# EAGLE design RAMPS_1.6.2 (EAGLE 9.1.1)
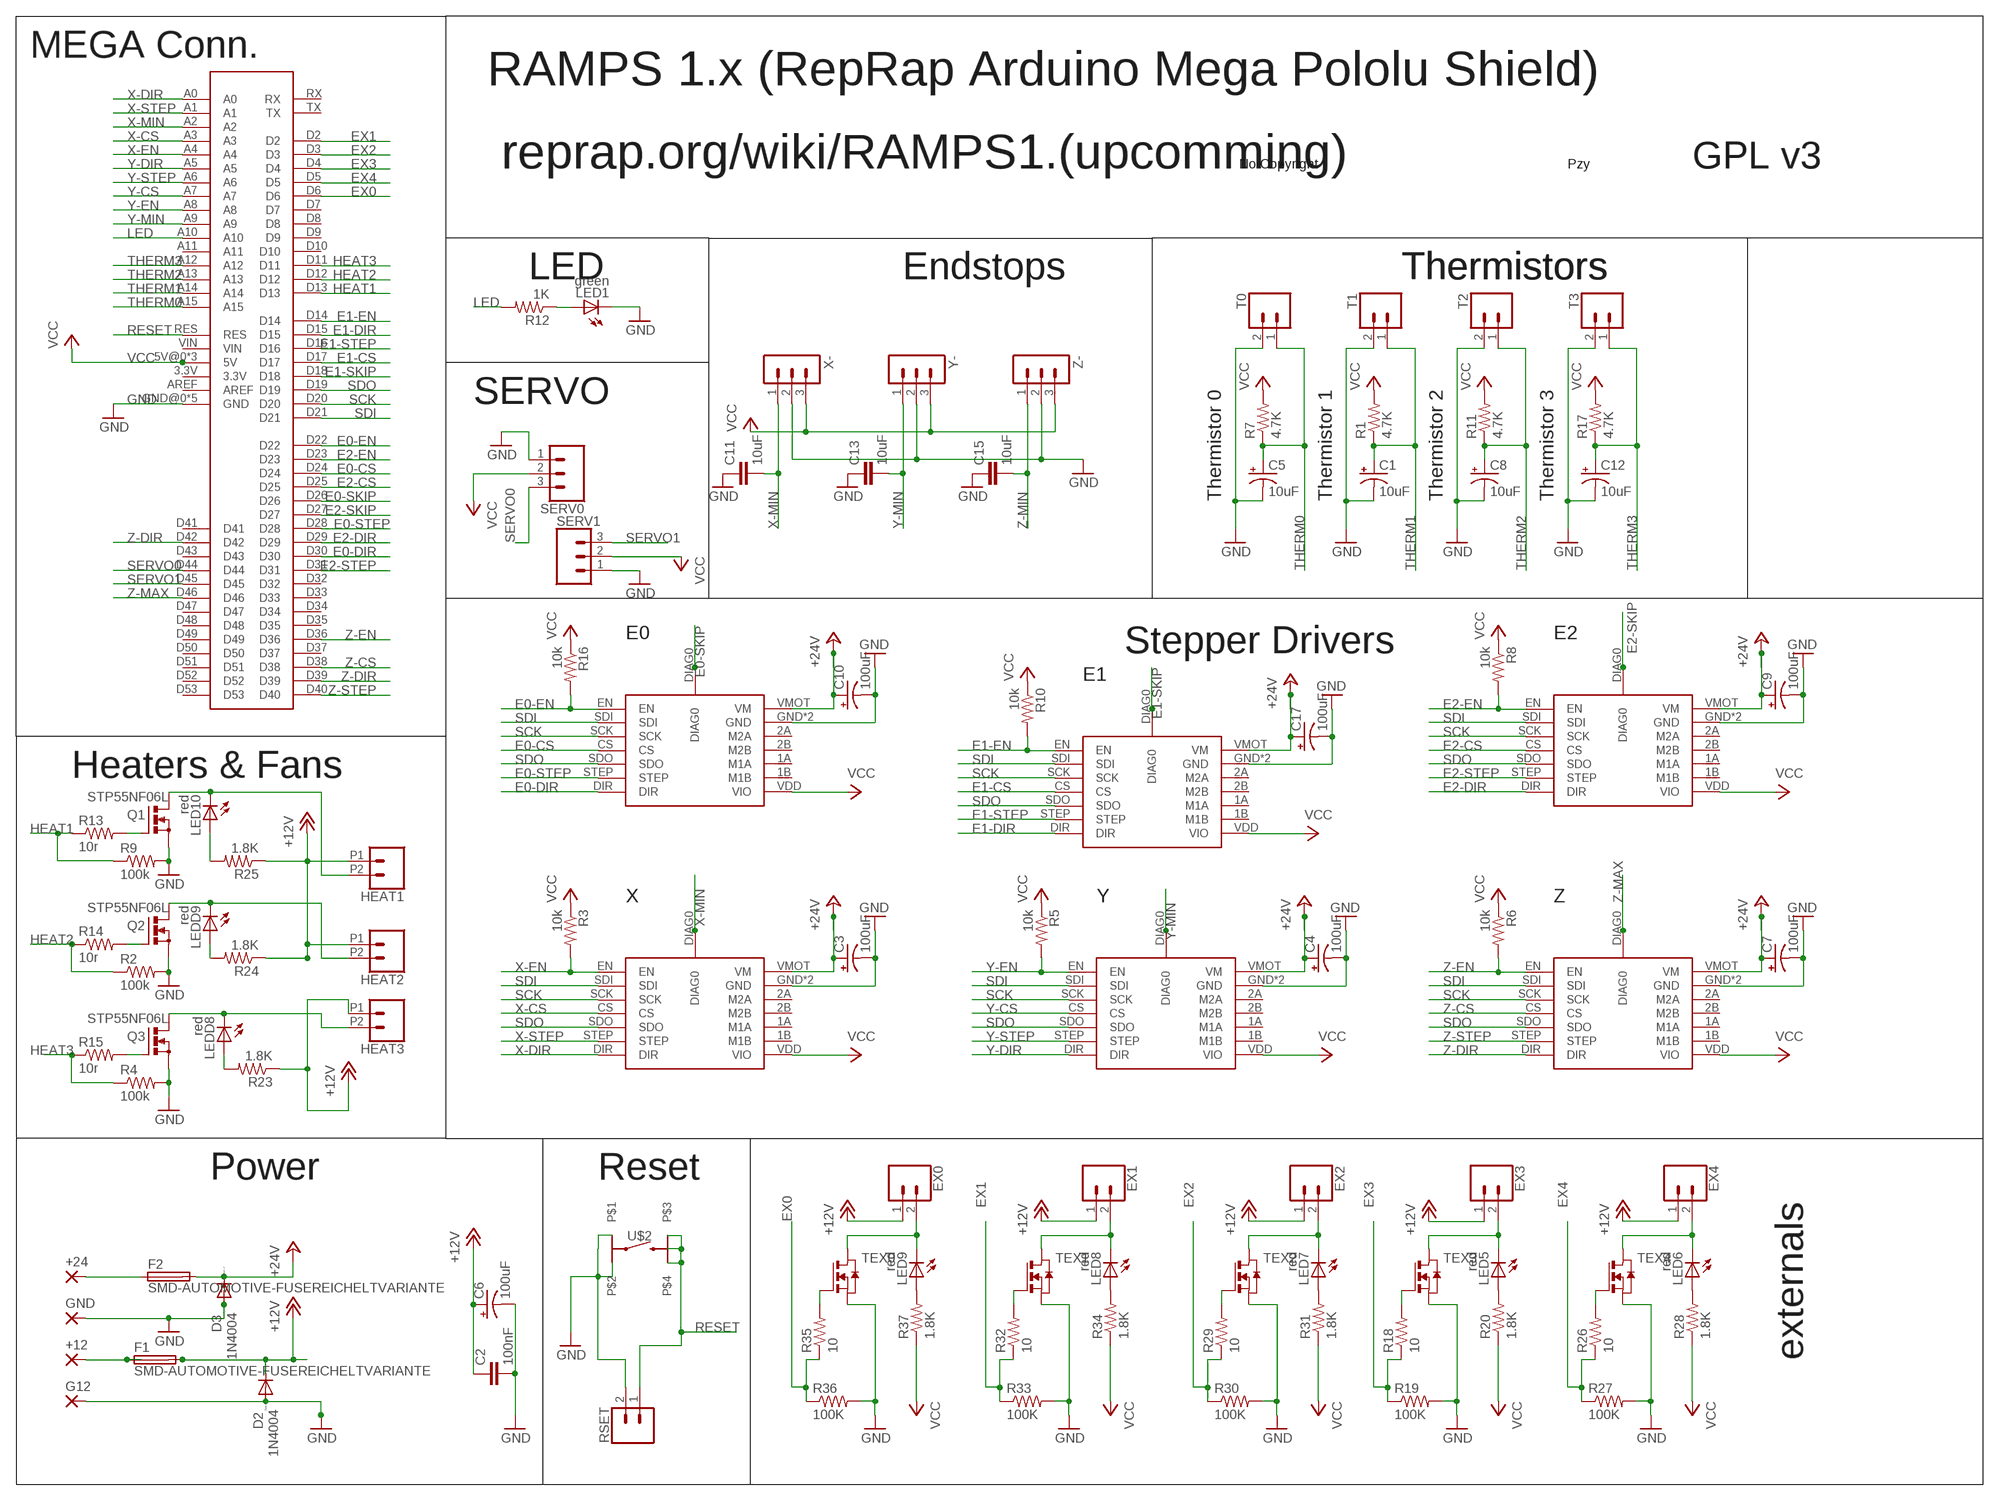
[diagram p0: schematic, sheet 1]

## Parts
+12  2,15/1,0  [2,15/1,0]
+24  2,15/1,0  [2,15/1,0]
C1  10uF  CPOL-US153CLV-0405  [153CLV-0405]
C2  100nF  C-EUC1206  [C1206]
C3  100uF  CPOL-US153CLV-0605  [153CLV-0605]
C4  100uF  CPOL-US153CLV-0605  [153CLV-0605]
C5  10uF  CPOL-US153CLV-0405  [153CLV-0405]
C6  100uF  CPOL-US153CLV-0605  [153CLV-0605]
C7  100uF  CPOL-US153CLV-0605  [153CLV-0605]
C8  10uF  CPOL-US153CLV-0405  [153CLV-0405]
C9  100uF  CPOL-US153CLV-0605  [153CLV-0605]
C10  100uF  CPOL-US153CLV-0605  [153CLV-0605]
C11  10uF  C-EUC1206  [C1206]
C12  10uF  CPOL-US153CLV-0405  [153CLV-0405]
C13  10uF  C-EUC1206  [C1206]
C15  10uF  C-EUC1206  [C1206]
C17  100uF  CPOL-US153CLV-0605  [153CLV-0605]
D2  1N4004  [DO41-10]
D3  1N4004  [DO41-10]
E0  TMC2130DIAG  [TMC2130DIAG0]
E1  TMC2130DIAG  [TMC2130DIAG0]
E2  TMC2130DIAG  [TMC2130DIAG0]
EX0  CONN_02POLAR_LOCK  [MOLEX-1X2_LOCK]
EX1  CONN_02POLAR_LOCK  [MOLEX-1X2_LOCK]
EX2  CONN_02POLAR_LOCK  [MOLEX-1X2_LOCK]
EX3  CONN_02POLAR_LOCK  [MOLEX-1X2_LOCK]
EX4  CONN_02POLAR_LOCK  [MOLEX-1X2_LOCK]
F1  SMD-AUTOMOTIVE-FUSEREICHELTVARIANTE  [RS-SMDFUSE]
F2  SMD-AUTOMOTIVE-FUSEREICHELTVARIANTE  [RS-SMDFUSE]
G12  2,15/1,0  [2,15/1,0]
GND  2,15/1,0  [2,15/1,0]
HEAT1  CONN_022.54MM_SCREWTERM  [1X02_2.54_SCREWTERM]
HEAT2  CONN_022.54MM_SCREWTERM  [1X02_2.54_SCREWTERM]
HEAT3  CONN_022.54MM_SCREWTERM  [1X02_2.54_SCREWTERM]
LED1  green  LEDCHIPLED_1206  [CHIPLED_1206]
LED5  red  LEDCHIPLED_1206  [CHIPLED_1206]
LED6  red  LEDCHIPLED_1206  [CHIPLED_1206]
LED7  red  LEDCHIPLED_1206  [CHIPLED_1206]
LED8  red  LEDCHIPLED_1206  [CHIPLED_1206]
LED9  red  LEDCHIPLED_1206  [CHIPLED_1206]
LED10  red  LEDCHIPLED_1206  [CHIPLED_1206]
LEDD8  red  LEDCHIPLED_1206  [CHIPLED_1206]
LEDD9  red  LEDCHIPLED_1206  [CHIPLED_1206]
Q1  STP55NF06L  IRF512  [TO220BV]
Q2  STP55NF06L  IRF512  [TO220BV]
Q3  STP55NF06L  IRF512  [TO220BV]
R1  4.7K  R-US_R1206  [R1206]
R2  100k  R-US_R1206  [R1206]
R3  10k  R-US_R1206  [R1206]
R4  100k  R-US_R1206  [R1206]
R5  10k  R-US_R1206  [R1206]
R6  10k  R-US_R1206  [R1206]
R7  4.7K  R-US_R1206  [R1206]
R8  10k  R-US_R1206  [R1206]
R9  100k  R-US_R1206  [R1206]
R10  10k  R-US_R1206  [R1206]
R11  4.7K  R-US_R1206  [R1206]
R12  1K  R-US_R1206  [R1206]
R13  10r  R-US_R1206  [R1206]
R14  10r  R-US_R1206  [R1206]
R15  10r  R-US_R1206  [R1206]
R16  10k  R-US_R1206  [R1206]
R17  4.7K  R-US_R1206  [R1206]
R18  10  R-US_R1206  [R1206]
R19  100K  R-US_R1206  [R1206]
R20  1.8K  R-US_R1206  [R1206]
R23  1.8K  R-US_R1206  [R1206]
R24  1.8K  R-US_R1206  [R1206]
R25  1.8K  R-US_R1206  [R1206]
R26  10  R-US_R1206  [R1206]
R27  100K  R-US_R1206  [R1206]
R28  1.8K  R-US_R1206  [R1206]
R29  10  R-US_R1206  [R1206]
R30  100K  R-US_R1206  [R1206]
R31  1.8K  R-US_R1206  [R1206]
R32  10  R-US_R1206  [R1206]
R33  100K  R-US_R1206  [R1206]
R34  1.8K  R-US_R1206  [R1206]
R35  10  R-US_R1206  [R1206]
R36  100K  R-US_R1206  [R1206]
R37  1.8K  R-US_R1206  [R1206]
RSET  CONN_02POLAR_LOCK  [MOLEX-1X2_LOCK]
SERV0  CONN_03  [1X03]
SERV1  CONN_03  [1X03]
T0  CONN_02LOCK  [1X02_LOCK]
T1  CONN_02LOCK  [1X02_LOCK]
T2  CONN_02LOCK  [1X02_LOCK]
T3  CONN_02LOCK  [1X02_LOCK]
TEX0  NMOSSOT223  [SOT223]
TEX1  NMOSSOT223  [SOT223]
TEX2  NMOSSOT223  [SOT223]
TEX3  NMOSSOT223  [SOT223]
TEX4  NMOSSOT223  [SOT223]
U$1  ARDUINOSHIELD  [REPRAPJR_ARDUINO_MEGA_SHIELD]
U$2  RS-TASTER  [RS-SWITCH]
X  TMC2130DIAG  [TMC2130DIAG0]
X-  3PIN-HEADER  [3PIN-HEADER]
Y  TMC2130DIAG  [TMC2130DIAG0]
Y-  3PIN-HEADER  [3PIN-HEADER]
Z  TMC2130DIAG  [TMC2130DIAG0]
Z-  3PIN-HEADER  [3PIN-HEADER]

## Nets
+12V [12pow]: C2.1 C6.+ D2.C EX0.1 EX1.1 EX2.1 EX3.1 EX4.1 F1.P$5 F1.P$6 F1.P$7 F1.P$8 HEAT1.P1 HEAT2.P1 HEAT3.P1 R23.1 R24.1 R25.1
+24V: C3.+ C4.+ C7.+ C9.+ C10.+ C17.+ D3.C E0.VMOT(VM) E1.VMOT(VM) E2.VMOT(VM) F2.P$5 F2.P$6 F2.P$7 F2.P$8 X.VMOT(VM) Y.VMOT(VM) Z.VMOT(VM)
E0-CS [signal]: E0.CS U$1.D24
E0-DIR [signal]: E0.DIR U$1.D30
E0-EN [signal]: E0.EN R16.2 U$1.D22
E0-SKIP [signal]: E0.DIAG0 U$1.D26
E0-STEP [signal]: E0.STEP U$1.D28
E1-CS [signal]: E1.CS U$1.D17
E1-DIR [signal]: E1.DIR U$1.D15
E1-EN [signal]: E1.EN R10.2 U$1.D14
E1-SKIP [signal]: E1.DIAG0 U$1.D18
E1-STEP [signal]: E1.STEP U$1.D16
E2-CS [signal]: E2.CS U$1.D25
E2-DIR [signal]: E2.DIR U$1.D29
E2-EN [signal]: E2.EN R8.2 U$1.D23
E2-SKIP: E2.DIAG0 U$1.D27
E2-STEP [signal]: E2.STEP U$1.D31
EX0 [signal]: R35.1 R36.1 U$1.D6
EX1 [signal]: R32.1 R33.1 U$1.D2
EX2 [signal]: R29.1 R30.1 U$1.D3
EX3 [signal]: R18.1 R19.1 U$1.D4
EX4 [signal]: R26.1 R27.1 U$1.D5
GND [signal]: C1.- C2.2 C3.- C4.- C5.- C6.- C7.- C8.- C9.- C10.- C11.1 C12.- C13.1 C15.1 C17.- D2.A D3.A E0.GND E0.GND@0(GND) E1.GND E1.GND@0(GND) E2.GND E2.GND@0(GND) G12.1(P) GND.1(P) LED1.C Q1.S Q2.S Q3.S R2.2 R4.2 R9.2 R19.2 R27.2 R30.2 R33.2 R36.2 RSET.2 SERV0.1 SERV1.1 T0.2 T1.2 T2.2 T3.2 TEX0.3(S) TEX1.3(S) TEX2.3(S) TEX3.3(S) TEX4.3(S) U$1.GND@0(GND) U$1.GND@1(GND) U$1.GND@2(GND) U$1.GND@3(GND) U$1.GND@4(GND) U$2.P$1 U$2.P$2 X-.2 X.GND X.GND@0(GND) Y-.2 Y.GND Y.GND@0(GND) Z-.2 Z.GND Z.GND@0(GND)
HEAT1 [signal]: R9.1 R13.1 U$1.D13
HEAT2 [signal]: R2.1 R14.1 U$1.D12
HEAT3 [signal]: R4.1 R15.1 U$1.D11
LED [signal]: R12.2 U$1.A10
N$1 [signal]: HEAT2.P2 LEDD9.C Q2.D
N$2 [signal]: R18.2 TEX3.1(G)
N$7 [signal]: HEAT1.P2 LED10.C Q1.D
N$12 [signal]: EX3.2 LED5.C TEX3.2(D) TEX3.4(D)
N$17 [signal]: LED5.A R20.2
N$22 [signal]: EX2.2 LED7.C TEX2.2(D) TEX2.4(D)
N$24 [signal]: R26.2 TEX4.1(G)
N$28 [signal]: EX4.2 LED6.C TEX4.2(D) TEX4.4(D)
N$32 [signal]: LEDD8.A R23.2
N$34 [signal]: LED6.A R28.2
N$36 [signal]: R29.2 TEX2.1(G)
N$38 [signal]: LED7.A R31.2
N$40 [signal]: R32.2 TEX1.1(G)
N$41 [signal]: EX1.2 LED8.C TEX1.2(D) TEX1.4(D)
N$42 [signal]: LED8.A R34.2
N$44 [signal]: R35.2 TEX0.1(G)
N$45 [signal]: LEDD9.A R24.2
N$46 [signal]: LED1.A R12.1
N$47 [signal]: Q2.G R14.2
N$48 [signal]: Q1.G R13.2
N$49 [signal]: Q3.G R15.2
N$50 [signal]: LED10.A R25.2
N$51 [signal]: HEAT3.P2 LEDD8.C Q3.D
N$53: +24.1(P) F2.P$1 F2.P$2 F2.P$3 F2.P$4
N$54 [signal]: +12.1(P) F1.P$1 F1.P$2 F1.P$3 F1.P$4
N$56 [signal]: EX0.2 LED9.C TEX0.2(D) TEX0.4(D)
N$57 [signal]: LED9.A R37.2
RESET [signal]: RSET.1 U$1.RES U$2.P$3 U$2.P$4
SCK [signal]: E0.SCK E1.SCK E2.SCK U$1.D20 X.SCK Y.SCK Z.SCK
SDI [signal]: E0.SDI E1.SDI E2.SDI U$1.D21 X.SDI Y.SDI Z.SDI
SDO [signal]: E0.SDO E1.SDO E2.SDO U$1.D19 X.SDO Y.SDO Z.SDO
SERVO0 [signal]: SERV0.3 U$1.D44
SERVO1 [signal]: SERV1.3 U$1.D45
THERM0 [signal]: C5.+ R7.1 T0.1 U$1.A15
THERM1 [signal]: C1.+ R1.1 T1.1 U$1.A14
THERM2 [signal]: C8.+ R11.1 T2.1 U$1.A13
THERM3 [signal]: C12.+ R17.1 T3.1 U$1.A12
VCC [vcc]: E0.VDD(VIO) E1.VDD(VIO) E2.VDD(VIO) R1.2 R3.1 R5.1 R6.1 R7.2 R8.1 R10.1 R11.2 R16.1 R17.2 R20.1 R28.1 R31.1 R34.1 R37.1 SERV0.2 SERV1.2 U$1.5V@0(5V) U$1.5V@1(5V) U$1.5V@2(5V) X-.3 X.VDD(VIO) Y-.3 Y.VDD(VIO) Z-.3 Z.VDD(VIO)
X-CS [signal]: U$1.A3 X.CS
X-DIR [signal]: U$1.A0 X.DIR
X-EN [signal]: R3.2 U$1.A4 X.EN
X-MIN [signal]: C11.2 U$1.A2 X-.1 X.DIAG0
X-STEP [signal]: U$1.A1 X.STEP
Y-CS [signal]: U$1.A7 Y.CS
Y-DIR [signal]: U$1.A5 Y.DIR
Y-EN [signal]: R5.2 U$1.A8 Y.EN
Y-MIN [signal]: C13.2 U$1.A9 Y-.1 Y.DIAG0
Y-STEP [signal]: U$1.A6 Y.STEP
Z-CS [signal]: U$1.D38 Z.CS
Z-DIR [signal]: U$1.D39 U$1.D42 Z.DIR
Z-EN [signal]: R6.2 U$1.D36 Z.EN
Z-MAX [signal]: U$1.D46 Z.DIAG0
Z-MIN [signal]: C15.2 Z-.1
Z-STEP [signal]: U$1.D40 Z.STEP
Unconnected: E0.1A(M1A) E0.1B(M1B) E0.2A(M2A) E0.2B(M2B) E1.1A(M1A) E1.1B(M1B) E1.2A(M2A) E1.2B(M2B) E2.1A(M1A) E2.1B(M1B) E2.2A(M2A) E2.2B(M2B) U$1.3.3V U$1.A11 U$1.AREF U$1.D7 U$1.D8 U$1.D9 U$1.D10 U$1.D32 U$1.D33 U$1.D34 U$1.D35 U$1.D37 U$1.D41 U$1.D43 U$1.D47 U$1.D48 U$1.D49 U$1.D50 U$1.D51 U$1.D52 U$1.D53 U$1.RX U$1.TX U$1.VIN X.1A(M1A) X.1B(M1B) X.2A(M2A) X.2B(M2B) Y.1A(M1A) Y.1B(M1B) Y.2A(M2A) Y.2B(M2B) Z.1A(M1A) Z.1B(M1B) Z.2A(M2A) Z.2B(M2B)

## Notes on the sheet
- MEGA Conn.
- RAMPS 1.x (RepRap Arduino Mega Pololu Shield)
- reprap.org/wiki/RAMPS1.(upcomming) | No Copyright | Pzy | GPL v3
- LED | Endstops | Thermistors | Thermistors
- SERVO
- Thermistor 0 | Thermistor 1 | Thermistor 2 | Thermistor 3
- E0 | E2
- Stepper Drivers
- E1
- Heaters & Fans
- X | Y | Z
- Power | Reset
- externals

## Library data of the parts
+12 +24 G12 GND = wirepad:2,15/1,0: THROUGH-HOLE PAD
C1 C3-C10 C12 C17 = adafruit:CPOL-US: POLARIZED CAPACITOR, American symbol
C2 = resistor:C-EU: CAPACITOR, European symbol
C11 C13 C15 = rcl:C-EU: CAPACITOR, European symbol; SPICEPREFIX: C
D2 D3 = diode:1N4004: DIODE general purpose rectifier, 1 A
E0 E1 E2 X Y Z = RAMPS_1.4.2.3:TMC2130DIAG
EX0 EX1-EX4 RSET = SparkFun-Connectors:CONN_02: Multi connection point. Often used as Generic Header-pin footprint for 0.1 inch spaced/style header connections On any of the 0.1 inch spaced packages, you can populate with these: Break Away Headers - Straight <https://www.sparkfun.com/products/116> (PRT-00116) Break Away Male Headers - Right Angle <https://www.sparkfun.com/products/553> (PRT-00553) Female Headers <https://www.sparkfun.com/products/115> (PRT-00115) Break Away Headers - Machine Pin <https://www.sparkfun.com/products/117> (PRT-00117) Break Away Female Headers - Swiss Machine Pin <https://www.sparkfun.com/products/743> (PRT-00743) For SCREWTERMINALS and SPRING TERMINALS visit here: Screw Terimnals on SparkFun.com <https://www.sparkfun.com/search/results?term=Screw+Terminals> (5mm/3.5mm/2.54mm spacing) This device is also useful as a general connection point to wire up your design to another part of your project. Our various solder wires solder well into these plated through hole pads. Hook-Up Wire - Assortment (Stranded, 22 AWG) <https://www.sparkfun.com/products/11375> (PRT-11375) Hook-Up Wire - Assortment (Solid Core, 22 AWG) <https://www.sparkfun.com/products/11367> (PRT-11367) View the entire wire category on our website here <https://www.sparkfun.com/categories/141> Special notes: Molex polarized connector foot print use with: PRT-08233 with associated crimp pins and housings. 2.54_SCREWTERM for use with PRT-10571. 3.5mm Screw Terminal footprints for PRT-08084 5mm Screw Terminal footprints for use with PRT-08432; SF_ID: PRT-09918; SPICEPREFIX: B
F1 F2 = My lib:SMD-AUTOMOTIVE-FUSE: Surface mount fuse holder for kfz blade fuses eu.mouser.com/ProductDetail/Keystone-Electronics/3588?qs=sGAEpiMZZMtRmoYvq3OwzPu1j8c6R%252bXbiEp%2fc%252bjR%2fsE%3d
HEAT1-HEAT3 T0 T1-T3 = SparkFun-Connectors:CONN_02: Multi connection point. Often used as Generic Header-pin footprint for 0.1 inch spaced/style header connections On any of the 0.1 inch spaced packages, you can populate with these: Break Away Headers - Straight <https://www.sparkfun.com/products/116> (PRT-00116) Break Away Male Headers - Right Angle <https://www.sparkfun.com/products/553> (PRT-00553) Female Headers <https://www.sparkfun.com/products/115> (PRT-00115) Break Away Headers - Machine Pin <https://www.sparkfun.com/products/117> (PRT-00117) Break Away Female Headers - Swiss Machine Pin <https://www.sparkfun.com/products/743> (PRT-00743) For SCREWTERMINALS and SPRING TERMINALS visit here: Screw Terimnals on SparkFun.com <https://www.sparkfun.com/search/results?term=Screw+Terminals> (5mm/3.5mm/2.54mm spacing) This device is also useful as a general connection point to wire up your design to another part of your project. Our various solder wires solder well into these plated through hole pads. Hook-Up Wire - Assortment (Stranded, 22 AWG) <https://www.sparkfun.com/products/11375> (PRT-11375) Hook-Up Wire - Assortment (Solid Core, 22 AWG) <https://www.sparkfun.com/products/11367> (PRT-11367) View the entire wire category on our website here <https://www.sparkfun.com/categories/141> Special notes: Molex polarized connector foot print use with: PRT-08233 with associated crimp pins and housings. 2.54_SCREWTERM for use with PRT-10571. 3.5mm Screw Terminal footprints for PRT-08084 5mm Screw Terminal footprints for use with PRT-08432
LED1 LED10 LEDD8 LEDD9 = led:LED: LED OSRAM: - CHIPLED LG R971, LG N971, LY N971, LG Q971, LY Q971, LO R971, LY R971 LH N974, LH R974 LS Q976, LO Q976, LY Q976 LO Q996 - Hyper CHIPLED LW Q18S LB Q993, LB Q99A, LB R99A - SideLED LS A670, LO A670, LY A670, LG A670, LP A670 LB A673, LV A673, LT A673, LW A673 LH A674 LY A675 LS A676, LA A676, LO A676, LY A676, LW A676 LS A679, LY A679, LG A679 - Hyper Micro SIDELED® LS Y876, LA Y876, LO Y876, LY Y876 LT Y87S - SmartLED LW L88C, LW L88S LB L89C, LB L89S, LG L890 LS L89K, LO L89K, LY L89K LS L896, LA L896, LO L896, LY L896 - TOPLED LS T670, LO T670, LY T670, LG T670, LP T670 LSG T670, LSP T670, LSY T670, LOP T670, LYG T670 LG T671, LOG T671, LSG T671 LB T673, LV T673, LT T673, LW T673 LH T674 LS T676, LA T676, LO T676, LY T676, LB T676, LH T676, LSB T676, LW T676 LB T67C, LV T67C, LT T67C, LS T67K, LO T67K, LY T67K, LW E67C LS E67B, LA E67B, LO E67B, LY E67B, LB E67C, LV E67C, LT E67C LW T67C LS T679, LY T679, LG T679 LS T770, LO T770, LY T770, LG T770, LP T770 LB T773, LV T773, LT T773, LW T773 LH T774 LS E675, LA E675, LY E675, LS T675 LS T776, LA T776, LO T776, LY T776, LB T776 LHGB T686 LT T68C, LB T68C - Hyper Mini TOPLED® LB M676 - Mini TOPLED Santana® LG M470 LS M47K, LO M47K, LY M47K Source: http://www.osram.convergy.de LUXEON: - LUMILED® LXK2-PW12-R00, LXK2-PW12-S00, LXK2-PW14-U00, LXK2-PW14-V00 LXK2-PM12-R00, LXK2-PM12-S00, LXK2-PM14-U00 LXK2-PE12-Q00, LXK2-PE12-R00, LXK2-PE12-S00, LXK2-PE14-T00, LXK2-PE14-U00 LXK2-PB12-K00, LXK2-PB12-L00, LXK2-PB12-M00, LXK2-PB14-N00, LXK2-PB14-P00, LXK2-PB14-Q00 LXK2-PR12-L00, LXK2-PR12-M00, LXK2-PR14-Q00, LXK2-PR14-R00 LXK2-PD12-Q00, LXK2-PD12-R00, LXK2-PD12-S00 LXK2-PH12-R00, LXK2-PH12-S00 LXK2-PL12-P00, LXK2-PL12-Q00, LXK2-PL12-R00 Source: www.luxeon.com KINGBRIGHT: KA-3528ASYC Source: www.kingbright.com
LED5-LED9 = led:LED: LED OSRAM: - CHIPLED LG R971, LG N971, LY N971, LG Q971, LY Q971, LO R971, LY R971 LH N974, LH R974 LS Q976, LO Q976, LY Q976 LO Q996 - Hyper CHIPLED LW Q18S LB Q993, LB Q99A, LB R99A - SideLED LS A670, LO A670, LY A670, LG A670, LP A670 LB A673, LV A673, LT A673, LW A673 LH A674 LY A675 LS A676, LA A676, LO A676, LY A676, LW A676 LS A679, LY A679, LG A679 - Hyper Micro SIDELED® LS Y876, LA Y876, LO Y876, LY Y876 LT Y87S - SmartLED LW L88C, LW L88S LB L89C, LB L89S, LG L890 LS L89K, LO L89K, LY L89K LS L896, LA L896, LO L896, LY L896 - TOPLED LS T670, LO T670, LY T670, LG T670, LP T670 LSG T670, LSP T670, LSY T670, LOP T670, LYG T670 LG T671, LOG T671, LSG T671 LB T673, LV T673, LT T673, LW T673 LH T674 LS T676, LA T676, LO T676, LY T676, LB T676, LH T676, LSB T676, LW T676 LB T67C, LV T67C, LT T67C, LS T67K, LO T67K, LY T67K, LW E67C LS E67B, LA E67B, LO E67B, LY E67B, LB E67C, LV E67C, LT E67C LW T67C LS T679, LY T679, LG T679 LS T770, LO T770, LY T770, LG T770, LP T770 LB T773, LV T773, LT T773, LW T773 LH T774 LS E675, LA E675, LY E675, LS T675 LS T776, LA T776, LO T776, LY T776, LB T776 LHGB T686 LT T68C, LB T68C - Hyper Mini TOPLED® LB M676 - Mini TOPLED Santana® LG M470 LS M47K, LO M47K, LY M47K Source: http://www.osram.convergy.de LUXEON: - LUMILED® LXK2-PW12-R00, LXK2-PW12-S00, LXK2-PW14-U00, LXK2-PW14-V00 LXK2-PM12-R00, LXK2-PM12-S00, LXK2-PM14-U00 LXK2-PE12-Q00, LXK2-PE12-R00, LXK2-PE12-S00, LXK2-PE14-T00, LXK2-PE14-U00 LXK2-PB12-K00, LXK2-PB12-L00, LXK2-PB12-M00, LXK2-PB14-N00, LXK2-PB14-P00, LXK2-PB14-Q00 LXK2-PR12-L00, LXK2-PR12-M00, LXK2-PR14-Q00, LXK2-PR14-R00 LXK2-PD12-Q00, LXK2-PD12-R00, LXK2-PD12-S00 LXK2-PH12-R00, LXK2-PH12-S00 LXK2-PL12-P00, LXK2-PL12-Q00, LXK2-PL12-R00 Source: www.luxeon.com KINGBRIGHT: KA-3528ASYC Source: www.kingbright.com; SPICEPREFIX: L
Q1-Q3 = transistor-power:IRF512: N-CHANNEL MOS FET
R1-R12 R16 R17 R23-R25 = adafruit:R-US_: RESISTOR, American symbol
R13-R15 = resistor:R-US_: RESISTOR, American symbol
R18 R20 R26-R37 = resistor:R-US_: RESISTOR, American symbol; SPICEPREFIX: R
R19 = resistor:R-US_: RESISTOR, American symbol; SPICEPREFIX: L
SERV0 SERV1 = SparkFun-Connectors:CONN_03: Multi connection point. Often used as Generic Header-pin footprint for 0.1 inch spaced/style header connections On any of the 0.1 inch spaced packages, you can populate with these: Break Away Headers - Straight <https://www.sparkfun.com/products/116> (PRT-00116) Break Away Male Headers - Right Angle <https://www.sparkfun.com/products/553> (PRT-00553) Female Headers <https://www.sparkfun.com/products/115> (PRT-00115) Break Away Headers - Machine Pin <https://www.sparkfun.com/products/117> (PRT-00117) Break Away Female Headers - Swiss Machine Pin <https://www.sparkfun.com/products/743> (PRT-00743) Stackable Header - 3 Pin (Female, 0.1") <https://www.sparkfun.com/products/13875> (PRT-13875) For SCREWTERMINALS and SPRING TERMINALS visit here: Screw Terimnals on SparkFun.com <https://www.sparkfun.com/search/results?term=Screw+Terminals> (5mm/3.5mm/2.54mm spacing) This device is also useful as a general connection point to wire up your design to another part of your project. Our various solder wires solder well into these plated through hole pads. Hook-Up Wire - Assortment (Stranded, 22 AWG) <https://www.sparkfun.com/products/11375> (PRT-11375) Hook-Up Wire - Assortment (Solid Core, 22 AWG) <https://www.sparkfun.com/products/11367> (PRT-11367) View the entire wire category on our website here <https://www.sparkfun.com/categories/141> Special notes: Molex polarized connector foot print use with SKU : PRT-08232 with associated crimp pins and housings.
TEX0 TEX1-TEX4 = zetex:NMOSSOT223: MOS FET; OC_FARNELL: unknown; OC_NEWARK: unknown; SPICEPREFIX: J
U$1 = RAMPS_1.4.2.3:ARDUINOSHIELD: aus schaltplan kopierte version von amega
U$2 = My lib:RS-TASTER
X- Y- Z- = ultimachine:3PIN-HEADER: PIN HEADER

## Net classes
0 24v: width 0.508 mm, drill 0.254 mm, clearance 0.127 mm
1 12pow: width 1.524 mm, drill 0.254 mm, clearance 0.127 mm
2 signal: width 0.152 mm, drill 0.254 mm, clearance 0.254 mm
3 vcc: width 0.254 mm, drill 0.254 mm, clearance 0.127 mm

## Board
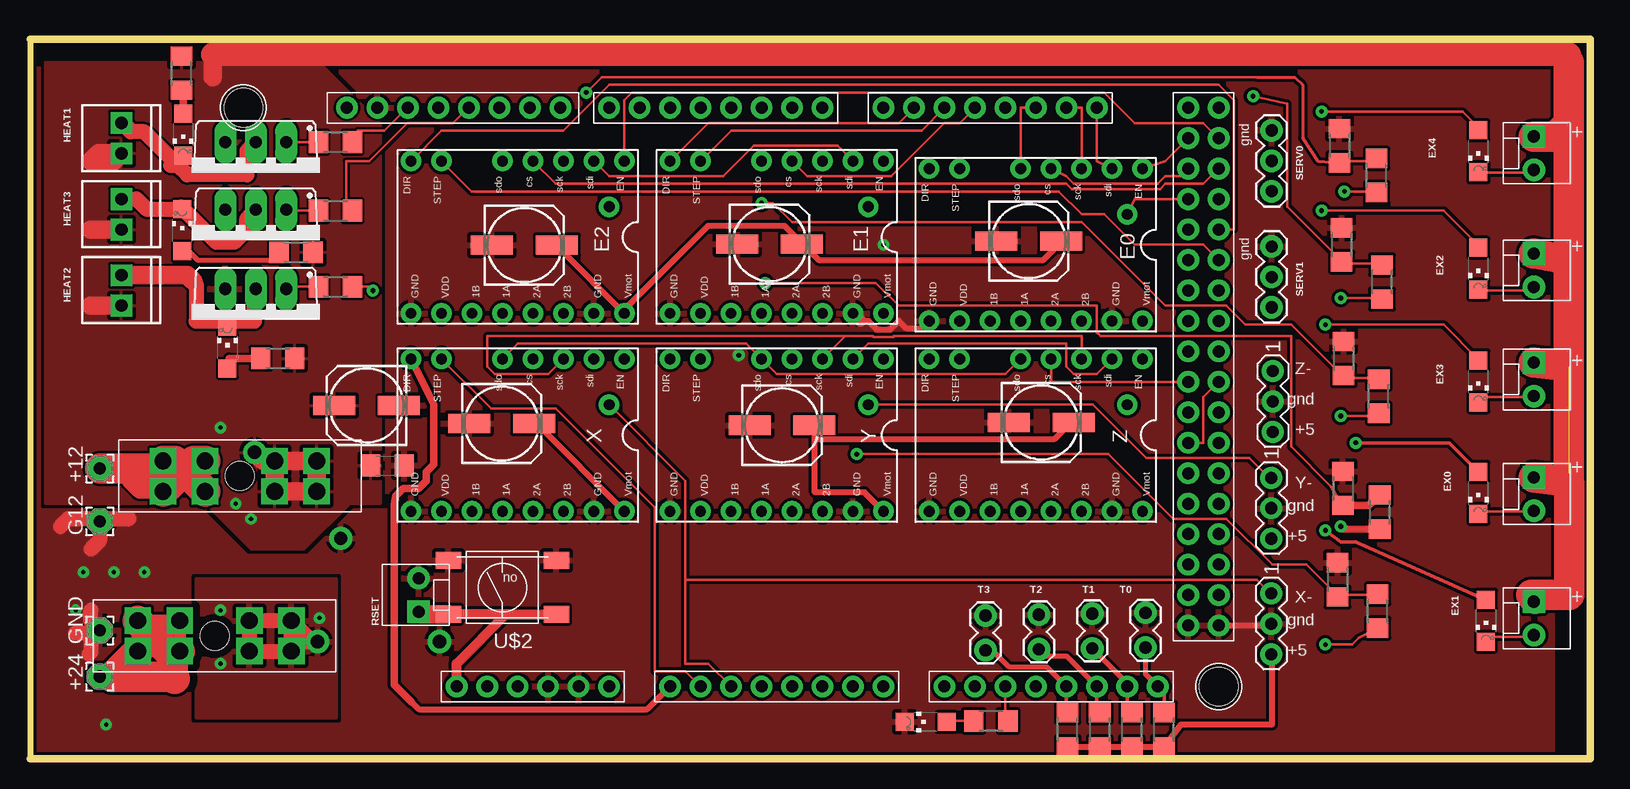
[diagram p1: board, top side]
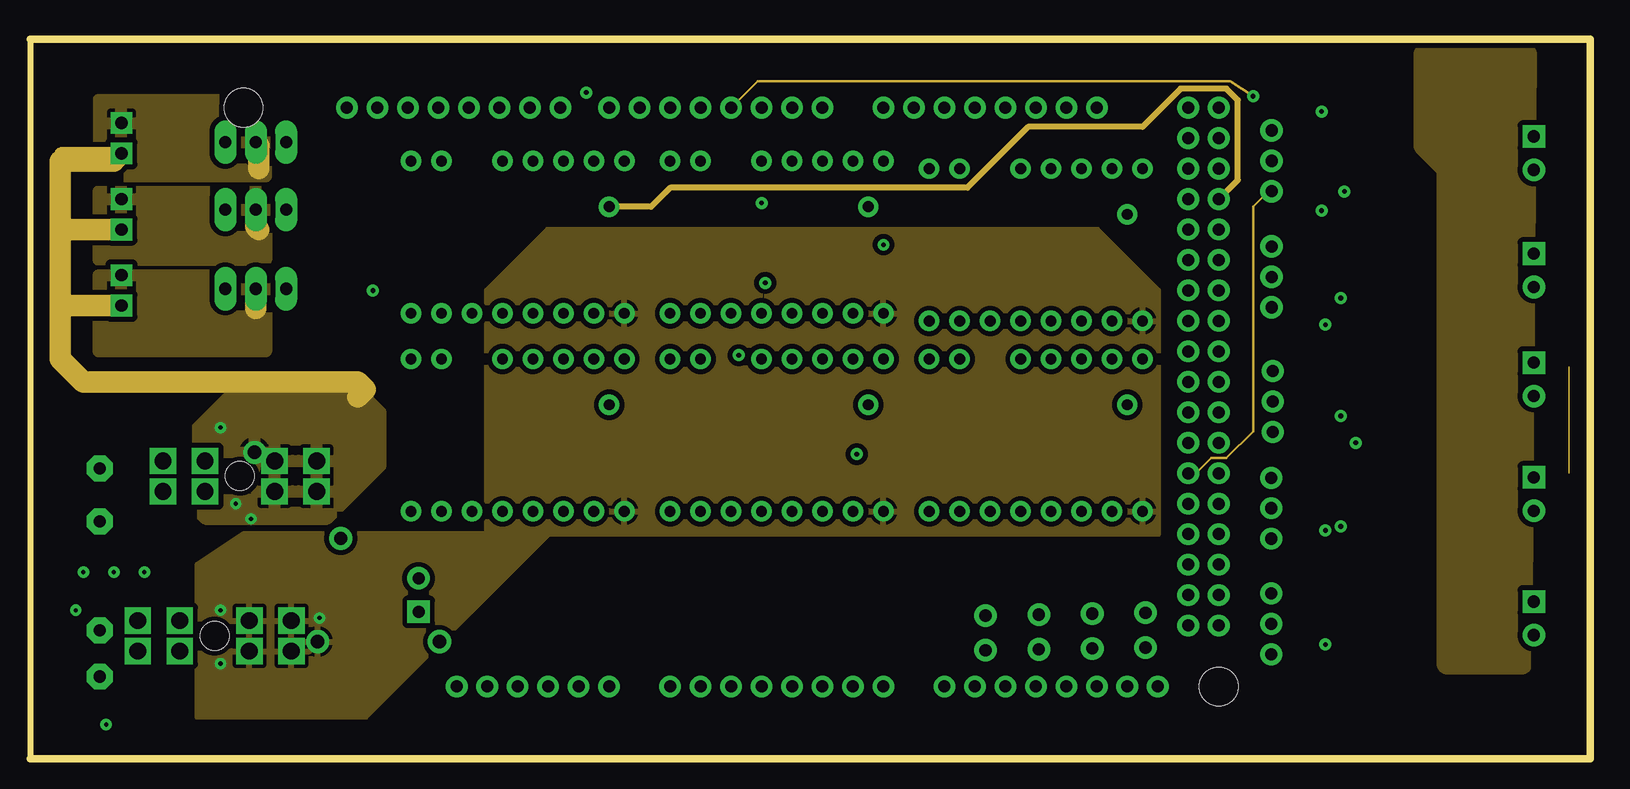
[diagram p2: board, inner layer Route2]
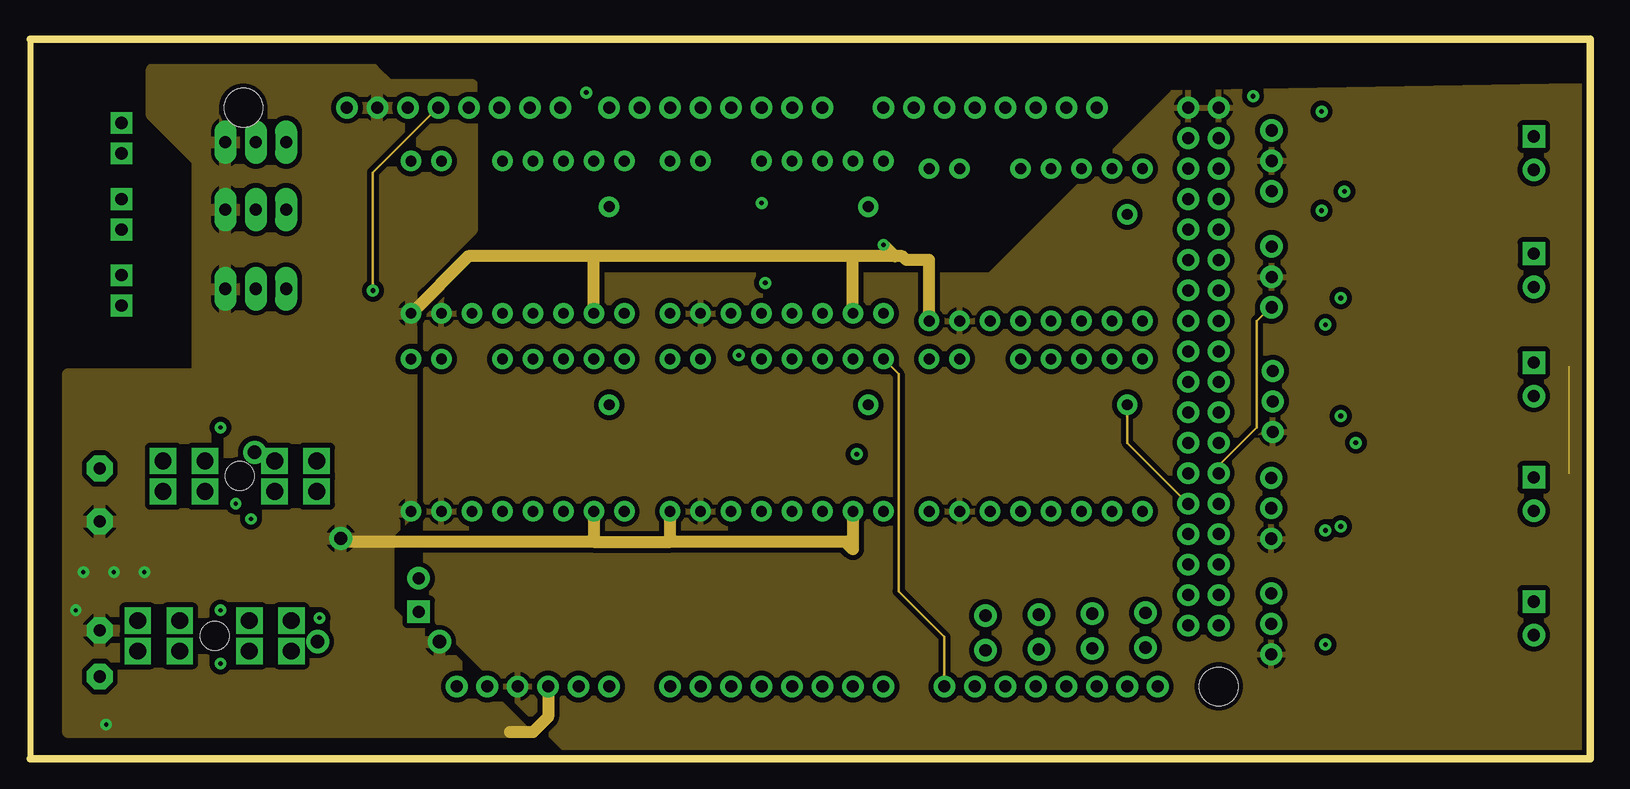
[diagram p3: board, inner layer Route3]
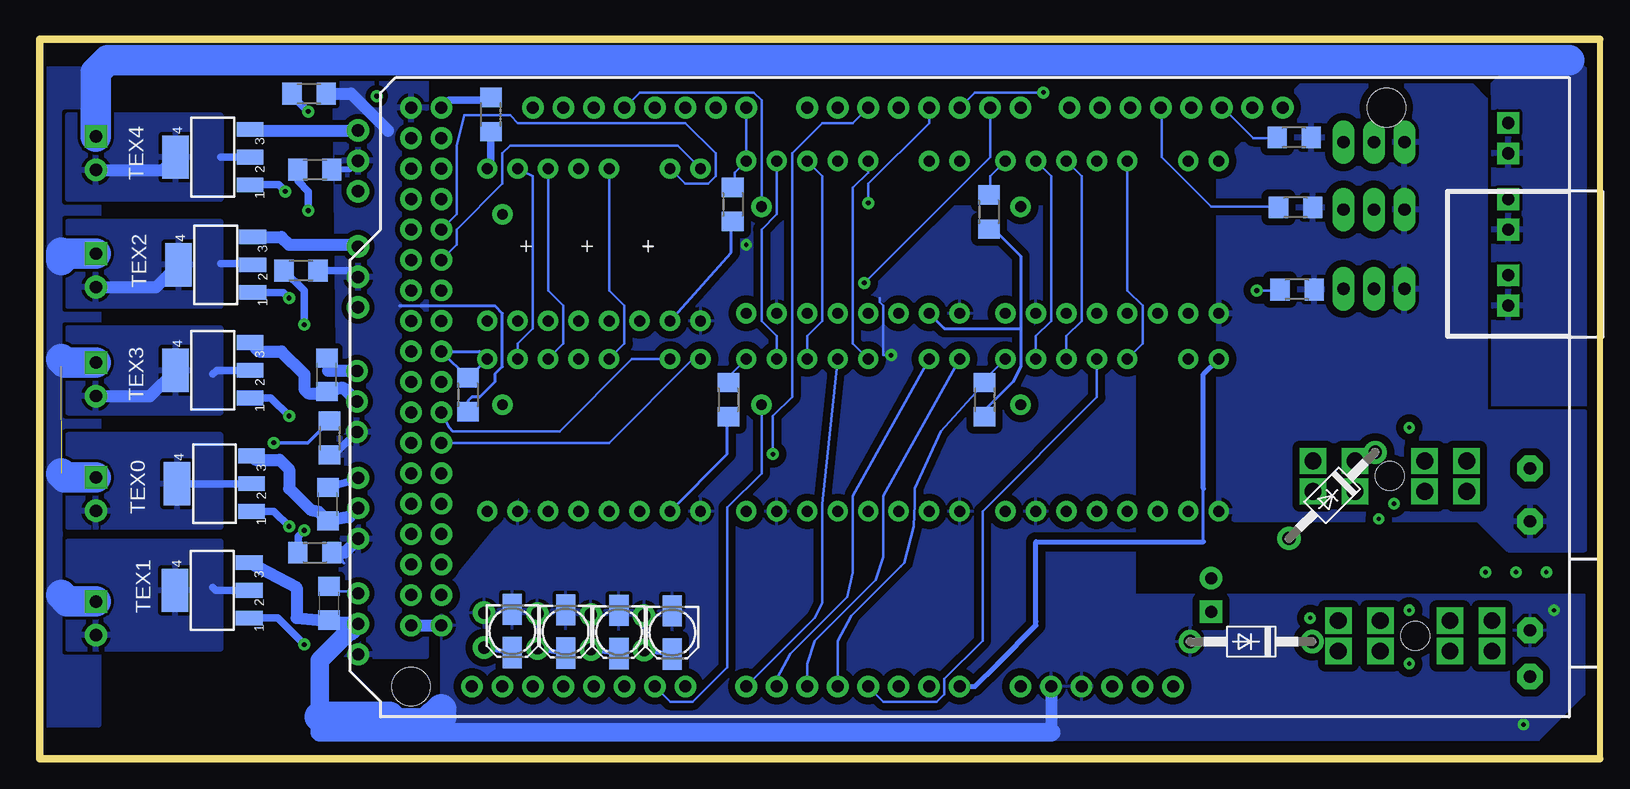
[diagram p4: board, bottom side, seen from below]

Size 130 x 60 mm. Coordinates in mm from the lower left corner, seen from the top.
Outline: 0,60 130,60 130,0 0,0 0,60
Copper layers (1*2*3*16): Top 0.035mm / dielectric 1.6mm / Route2 0.035mm / dielectric 0.15mm / Route3 0.035mm / dielectric 0.2mm / Bottom 0.035mm
Design rules "PCB-CART *": minimum track width 0.2mm, minimum drill 0.4mm, track to track 0.2mm, track to pad 0.2mm, pad to pad 0.2mm, via to via 0.2mm, smd to smd 0.2mm, copper to edge 0.2mm, drill to drill 0.2mm, minimum pad ring 0.4mm, minimum via ring 0.3mm, stop-mask expansion 3mil, vias tented up to drill 0.5mm, thermal gap 12mil

### Footprints (pad centres in the part's own frame; a part is rotated, then mirrored left to right if it is on the bottom)
2,15/1,0 = drill 1.016 pad 2.159 octagon: 1 0,0
153CLV-0405 = smd 2.6 x 1.6: + 1.8,0; - -1.8,0
C1206 = smd 1.6 x 1.8: 1 -1.4,0; 2 1.4,0
153CLV-0605 = smd 3.5 x 1.6: + 2.7,0; - -2.7,0
DO41-10 = drill 1.118: A 5.08,0; C -5.08,0
TMC2130DIAG0 = drill 0.9: 1A 8.89,1.27; 1B 11.43,1.27; 2A 6.35,1.27; 2B 3.81,1.27; CS 6.35,-11.43; DIAG0 0,-7.62; DIR 16.51,-11.43; EN -1.27,-11.43; GND 16.51,1.27; GND@0 1.27,1.27; SCK 3.81,-11.43; SDI 1.27,-11.43; SDO 8.89,-11.43; STEP 13.97,-11.43; VDD 13.97,1.27; VMOT -1.27,1.27
MOLEX-1X2_LOCK = drill 1.016 pad 1.88 square: 1 -0.127,0 | drill 1.016 pad 1.88: 2 2.667,0
RS-SMDFUSE = drill 1.4 square: P$1 -6.4,1.27; P$2 -6.4,-1.27; P$3 -2.9,1.27; P$4 -2.9,-1.27; P$5 2.9,1.27; P$6 2.9,-1.27; P$7 6.4,1.27; P$8 6.4,-1.27 | hole 2.4: 0,0
1X02_2.54_SCREWTERM = drill 1.016 square: P1 2.54,0; P2 0,0
CHIPLED_1206 = smd 1.5 x 1.5: A 0,-1.75; C 0,1.75
TO220BV = drill 1.016 long: D 0,-2.54; G -2.54,-2.54; S 2.54,-2.54
R1206 = smd 1.6 x 1.803: 1 -1.422,0; 2 1.422,0
1X03 = drill 1.016 pad 1.88: 1 0,0; 2 2.54,0; 3 5.08,0
1X02_LOCK = drill 1.016 pad 1.88: 1 -0.178,0; 2 2.718,0
SOT223 = smd 1.219 x 2.235: 1 -2.311,-3.099; 2 0,-3.099; 3 2.311,-3.099 | smd 3.6 x 2.2: 4 0,3.099
REPRAPJR_ARDUINO_MEGA_SHIELD = drill 1 pad 1.422: 3.3V 35.56,2.54; 5V@0 38.1,2.54; 5V@1 93.98,50.8; 5V@2 96.52,50.8; A0 50.8,2.54; A1 53.34,2.54; A2 55.88,2.54; A3 58.42,2.54; A4 60.96,2.54; A5 63.5,2.54; A6 66.04,2.54; A7 68.58,2.54; A8 73.66,2.54; A9 76.2,2.54; A10 78.74,2.54; A11 81.28,2.54; A12 83.82,2.54; A13 86.36,2.54; A14 88.9,2.54; A15 91.44,2.54; AREF 23.876,50.8; D2 58.42,50.8; D3 55.88,50.8; D4 53.34,50.8; D5 50.8,50.8; D6 48.26,50.8; D7 45.72,50.8; D8 41.656,50.8; D9 39.116,50.8; D10 36.576,50.8; D11 34.036,50.8; D12 31.496,50.8; D13 28.956,50.8; D14 68.58,50.8; D15 71.12,50.8; D16 73.66,50.8; D17 76.2,50.8; D18 78.74,50.8; D19 81.28,50.8; D20 83.82,50.8; D21 86.36,50.8; D22 93.98,48.26; D23 96.52,48.26; D24 93.98,45.72; D25 96.52,45.72; D26 93.98,43.18; D27 96.52,43.18; D28 93.98,40.64; D29 96.52,40.64; D30 93.98,38.1; D31 96.52,38.1; D32 93.98,35.56; D33 96.52,35.56; D34 93.98,33.02; D35 96.52,33.02; D36 93.98,30.48; D37 96.52,30.48; D38 93.98,27.94; D39 96.52,27.94; D40 93.98,25.4; D41 96.52,25.4; D42 93.98,22.86; D43 96.52,22.86; D44 93.98,20.32; D45 96.52,20.32; D46 93.98,17.78; D47 96.52,17.78; D48 93.98,15.24; D49 96.52,15.24; D50 93.98,12.7; D51 96.52,12.7; D52 93.98,10.16; D53 96.52,10.16; GND@0 40.64,2.54; GND@1 43.18,2.54; GND@2 26.416,50.8; GND@3 93.98,7.62; GND@4 96.52,7.62; RES 33.02,2.54; RX 63.5,50.8; TX 60.96,50.8; VIN 45.72,2.54 | hole 3.2: 96.52,2.54; 15.24,50.8
RS-SWITCH = smd 2.1 x 1.4: P$1 4.5,-2.25; P$2 -4.5,-2.25; P$3 4.5,2.25; P$4 -4.5,2.25
3PIN-HEADER = drill 1.016: 1 -2.54,0; 2 0,0; 3 2.54,0

### Placement (x,y rotation side)
+12  5.81,24.2 90 top
+24  5.81,6.85 90 top
C1  86.17,10.61 270 bottom
C2  29.79,24.45 0 top
C3  61.63,42.91 0 top
C4  83.22,43.15 0 top
C5  90.62,10.65 270 bottom
C6  28.04,29.46 180 top
C7  62.67,27.8 0 top
C8  81.73,10.57 270 bottom
C9  84.26,28.04 0 top
C10  39.31,27.95 0 top
C11  105.89,12.96 90 bottom
C12  77.28,10.53 270 bottom
C13  105.98,21.22 90 bottom
C15  106.08,32.02 90 bottom
C17  41.2,42.82 0 top
D2  22.3,21.96 225 bottom
D3  29.04,9.76 180 bottom
E0  91.44,37.77 180 top
E1  69.85,38.41 180 top
E2  48.26,38.41 180 top
EX0  125.32,23.34 270 top
EX1  125.32,12.98 270 top
EX2  125.32,41.99 270 top
EX3  125.32,32.91 270 top
EX4  125.32,51.76 270 top
F1  17.49,23.56 0 top
F2  15.38,10.24 0 top
G12  5.81,19.78 90 top
GND  5.81,10.69 90 top
HEAT1  7.62,53.01 270 top
HEAT2  7.62,40.31 270 top
HEAT3  7.62,46.66 270 top
LED1  74.62,3.07 90 top
LED5  120.7,31.46 180 top
LED6  120.7,50.64 180 top
LED7  120.7,40.85 180 top
LED8  121.33,11.51 180 top
LED9  120.7,22.16 180 top
LED10  12.76,52.05 180 top
LEDD8  12.69,44.06 0 top
LEDD9  16.45,34.29 0 top
Q1  18.81,48.86 180 top
Q2  18.81,36.64 180 top
Q3  18.81,43.24 180 top
R1  91.83,2.42 270 top
R2  25.22,39.12 0 bottom
R3  51.27,29.95 90 bottom
R4  25.34,45.97 0 bottom
R5  72.62,29.95 90 bottom
R6  94.32,30.35 90 bottom
R7  94.5,2.42 270 top
R8  50.89,45.59 90 bottom
R9  25.46,51.8 0 bottom
R10  72.25,46.22 90 bottom
R11  89.15,2.42 270 top
R12  80.07,3.15 0 top
R13  25.46,51.41 180 top
R14  25.46,39.35 180 top
R15  25.46,45.7 180 top
R16  92.41,53.71 270 bottom
R17  86.47,2.42 270 top
R18  112.4,30.22 270 top
R19  109.47,33.37 90 top
R20  108.23,40.7 180 bottom
R23  22.16,42.23 180 top
R24  20.65,33.39 180 top
R25  12.64,57.15 270 top
R26  112.22,48.64 270 top
R27  109.12,51.1 90 top
R28  107.56,55.45 180 bottom
R29  112.67,39.75 270 top
R30  109.3,42.85 90 top
R31  107.08,49.12 180 bottom
R32  112.3,12.3 270 top
R33  108.96,14.92 90 top
R34  107.08,17.2 180 bottom
R35  112.48,20.56 270 top
R36  109.42,22.54 90 top
R37  105.85,26.74 90 bottom
RSET  32.38,12.37 90 top
SERV0  103.47,52.4 270 top
SERV1  103.47,42.71 270 top
T0  92.97,9.45 90 top
T1  88.52,9.37 90 top
T2  84.08,9.3 90 top
T3  79.63,9.22 90 top
TEX0  115.45,22.93 90 bottom
TEX1  115.62,14.04 90 bottom
TEX2  115.34,41.19 90 bottom
TEX3  115.58,32.39 90 bottom
TEX4  115.58,50.16 90 bottom
U$1  2.54,3.48 0 top
U$2  39.37,14.28 180 top
X  48.26,21.9 180 top
X-  103.45,11.25 270 top
Y  69.85,21.9 180 top
Y-  103.45,20.88 270 top
Z  91.44,21.9 180 top
Z-  103.57,29.79 270 top

### Tracks (layer width: path | path; a pad name or v marks a point on that pad's centre or on a via)
+12V  (via drill 0.35)  (1 unrouted)
  Top 1.524: 125.41,13.33 EX1.1 | 15.24,58.73 15.24,56.82 | F1.P$5 F1.P$7 F1.P$8 F1.P$6 F1.P$5 | D2.C 19.43,24.83 F1.P$5 | HEAT3.P1 5.08,44.12 | HEAT2.P1 5.08,37.77 | HEAT1.P1 5.71,50.47 5.08,49.84 6.99,49.84 HEAT1.P1
  Top 2: 128.22,58.09 128.27,58.73 15.24,58.73 | 15.24,58.73
  Top 2.54: EX4.1 127.1,51.89 128.22,53.01 | 128.22,53.01 128.22,58.09 | 128.22,53.01 128.24,41.59 | 128.24,41.59 128.25,32.7 | 128.25,32.7 128.27,13.64 125.1,13.64 125.41,13.33 | EX0.1 127.64,23.17 | EX3.1 128.25,32.7 | EX2.1 128.24,41.59
  Route2 1.016: HEAT1.P1 2.54,50.47 2.54,49.84
  Route2 1.778: 27.32,30.17 27.94,30.79 27.3,31.42 4.45,31.42 2.54,33.33 2.54,37.77 | 2.54,37.77 2.54,44.12 | 2.54,44.12 2.54,49.84 6.99,49.84 HEAT1.P1 | 2.54,44.12 HEAT3.P1 | HEAT2.P1 2.54,37.77
  Bottom 2.54: EX4.1 125.32,57.24 124.33,58.23 26.16,58.23 2.54,58.23 | EX2.1 128.17,42.12 128.22,42.17 128.22,42.22 128.22,41.59 | EX3.1 127.97,33.03 128.22,33.28 128.22,33.33 | EX0.1 127.93,23.46 128.22,23.76 128.22,23.8 | EX1.1 127.69,13.11 128.22,13.64
  other vias: 15.88,27.61 17.14,21.27 18.41,19.99
  pour Top (isolate 0.254): 1.27,58.09 1.27,21.27 14.61,21.27 18.41,17.45 22.86,17.45 26.67,21.27 29.21,21.27 29.21,53.01 24.13,58.09
  pour Bottom (isolate 0.254, rank 2): 125.1,57.46 130.18,57.46 130.18,2.85 125.1,2.85
  pour Bottom (isolate 0.254, rank 2): 8.89,56.19 8.89,29.52 1.27,29.52 1.27,57.46 1.91,58.09 6.99,58.09
  pour Route2 (isolate 0.406, rank 2): 13.97,27.61 13.97,20.63 14.61,19.99 24.77,19.99 29.21,24.44 29.21,28.88 27.94,30.15 16.51,30.15
  pour Top: 1.27,58.09 24.13,58.09 29.21,53.01 29.21,21.27 26.67,21.27 22.86,17.45 18.41,17.45 14.61,21.27 1.27,21.27
+24V  (via drill 0.35)
  Top 0.508: X.VMOT 42.23,27.93 C10.+ | C17.+ 44.13,42.54 E2.VMOT 49.53,37.46 56.52,44.44 62.87,44.44 64.14,43.17 C3.+ 64.45,42.85 65.72,41.59 84.46,41.59 85.73,42.85 C4.+ | 65.41,26.66 65.41,22.22 69.53,22.22 Y.VMOT | 65.41,26.66 65.41,27.61 C7.+ | 65.41,26.66 85.41,26.66 86.68,27.93 C9.+
  Top 1.27: F2.P$8 F2.P$6 F2.P$5 F2.P$7 | F2.P$8 F2.P$7 | F2.P$8 22.58,9.76 D3.C 23.53,9.76 F2.P$7
  other vias: 15.88,12.37 15.88,7.93 24.13,11.74
  pour Route2 (isolate 0.406, rank 3): 43.18,44.12 88.9,44.12 93.98,39.04 93.98,18.73 43.18,18.73 27.94,3.48 13.97,3.48 13.97,16.19 17.78,18.73 38.1,18.73 38.1,39.04
  pour Top (isolate 0.61): 13.97,14.92 25.4,14.92 25.4,3.48 13.97,3.48
E0-CS
  Top 0.2: E0.CS 86.36,48.57 | 94.62,48.57 95.89,48.57 U$1.D24
  Top 0.203: 86.36,48.57 87,47.93 93.98,47.93 94.62,48.57
E0-DIR
  Bottom 0.2: E0.DIR 76.84,51.11 90.81,51.11 91.44,50.47 91.44,47.93 95.25,44.12 95.25,42.85 U$1.D30
E0-EN
  Top 0.2: U$1.D22 94.62,49.84 E0.EN
  Bottom 0.61: R16.2 92.41,49.51 E0.EN
E0-SKIP
  Top 0.2: E0.DIAG0 92.08,46.66 U$1.D26
E0-STEP
  Bottom 0.2: E0.STEP 76.2,47.93 74.3,47.93 73.66,48.57 73.66,50.47 76.2,53.01 90.17,53.01 90.81,53.65 94.62,53.65 95.25,51.11 95.25,45.39 U$1.D28
E1-CS
  Top 0.2: E1.CS 64.77,48.57 71.76,48.57 76.2,53.01 77.47,53.01 U$1.D17
E1-DIR
  Top 0.2: E1.DIR 56.52,53.01 72.39,53.01 U$1.D15
E1-EN
  Bottom 0.2: R10.2 72.07,47.3 72.07,48.89 E1.EN U$1.D14
E1-SKIP
  Bottom 0.2: E1.DIAG0 69.85,54.92 70.48,55.55 80.01,55.55 U$1.D18
E1-STEP
  Top 0.2: E1.STEP 58.42,52.38 74.3,52.38 U$1.D16
E2-CS
  Top 0.2: E2.CS 43.81,47.93 86.35,47.93 86.81,47.48 94.17,47.48 94.62,47.93 97.79,47.93 U$1.D25
E2-DIR
  Top 0.2: E2.DIR 34.29,52.38 44.45,52.38 48.26,56.19 99.06,56.19 100.33,54.92 100.33,44.12 U$1.D29
E2-EN
  Top 0.2: U$1.D23 97.79,53.01 92.08,53.01 89.54,55.55 50.16,55.55 49.53,54.92 E2.EN
  Bottom 0.2: E2.EN 50.8,48.57 50.8,46.66 R8.2
E2-SKIP
  Route2 0.508: E2.DIAG0 51.75,46.03 53.34,47.62 78.11,47.62 83.19,52.7 92.71,52.7 95.89,55.87 99.7,55.87 100.65,54.92 100.65,48.25 U$1.D27
E2-STEP
  Top 0.2: E2.STEP 36.83,47.3 85.73,47.3 87.63,45.39 89.54,45.39 | 92.71,42.85 97.79,42.85 U$1.D31
  Top 0.203: 89.54,45.39 92.08,42.85 92.71,42.85
EX0  (via drill 0.4)
  Top 0.2: 112.39,21.95 R35.1 | 89.06,35.39 89.22,35.23 105.09,35.23 105.09,26.03 108.41,22.71 R36.1 | 86.36,37.77 72.39,37.77 70.48,39.68 v61.28,39.68
  Top 0.203: 86.36,37.77 88.9,37.77 88.9,35.55 89.06,35.39
  Top 0.61: R36.1 111.58,21.14 112.39,21.95
  Bottom 0.2: v61.28,39.68 50.8,50.16 U$1.D6
EX1  (via drill 0.4)
  Top 0.2: R32.1 112.08,13.64 109.22,13.64 R33.1 108.9,13.64 106.36,16.19 103.51,16.19 99.7,19.99 95.25,19.99 89.85,25.39 v68.9,25.39
  Bottom 0.2: v68.9,25.39 68.9,28.57 67.31,30.15 67.31,50.47 64.77,53.01 62.23,53.01 U$1.D2
EX2  (via drill 0.4)
  Top 0.2: R29.1 112.4,41.27 109.54,41.27 R30.1 109.22,41.59 104.78,46.03 104.78,54.6 v101.92,55.24
  Route2 0.2: v101.92,55.24 100.01,56.51 60.64,56.51 U$1.D3
EX3  (via drill 0.4)
  Top 0.2: R18.1 113.03,31.74 109.54,31.74 R19.1 109.22,32.06 105.09,36.19 101.28,36.19 99.7,37.77 94.62,37.77 87.63,44.76 63.5,44.76 61.91,46.35 v60.96,46.35
  Bottom 0.2: v60.96,46.35 60.96,47.93 55.88,53.01 U$1.D4
EX4  (via drill 0.4)
  Top 0.2: R27.1 109.22,49.84 112.08,49.84 R26.1 | 102.23,56.82 47.62,56.82 v46.35,55.55
  Top 0.254: 102.23,56.82 105.41,56.82 106.05,56.19 106.05,51.74 107.32,49.84 R27.1
  Bottom 0.2: v46.35,55.55 52.07,55.55 U$1.D5
GND  (via drill 0.35, 0.4)
  Top 0.508: 69.22,36.5 69.83,36.5 70.56,35.78 71.68,35.78 72.4,36.5 73.03,35.87 74.3,35.87 E0.GND | U$1.GND@4 103.3,11.1 X-.2
  Top 1.016: E1.GND@0 69.22,36.5
  Top 1.27: GND.1 5.58,10.47 3.81,10.47 | 5.08,17.45 5.81,18.19 G12.1 6.02,19.99 8.25,19.99 3.17,19.99 2.54,19.36 | GND.1 5.08,9.96 5.08,8.9 4.91,8.73 | GND.1 5.08,11.42 5.08,12.37
  Route3 1.016: U$1.GND@0 43.18,3.48 41.91,2.21 40.01,2.21 | X.GND@0 46.99,18.09 | 46.99,18.09 53.34,18.09 | 53.34,18.09 Y.GND | 46.99,18.09 26.17,18.09 D2.A | Y.GND@0 68.58,17.45 67.95,18.09 53.34,18.09 | E0.GND 74.93,41.59 73.03,41.59 72.71,41.9 72.07,41.9 | 72.07,41.9 v71.12,42.85 | 68.58,41.9 46.99,41.9 | 46.99,41.9 36.51,41.9 E2.GND | E2.GND@0 46.99,41.9 | E1.GND@0 68.58,41.9 | 72.07,41.9 68.58,41.9
  Bottom 0.2: C11.1 105.73,11.74 103.82,11.74 103.51,11.42 X-.2 | C15.1 106.16,30.47 | 103.51,42.85 SERV1.1 | 103.51,52.38 SERV0.1 | E1.GND 53.44,37.24 | 60.01,38.41 60.01,38.09 59.69,37.77 59.69,33.65 v59.05,33.65
  Bottom 1.016: TEX2.3 109.87,43.5 109.22,42.85 103.51,42.85 | TEX4.3 112.39,52.38 103.51,52.38 | TEX3.3 111.74,33.96 109.86,33.96 107.95,32.06 107.95,30.79 107.63,30.47 106.16,30.47 | TEX0.3 112.02,24.92 110.01,24.92 109.22,24.12 109.22,22.53 107.43,20.75 106.77,20.61 C13.1 104.19,20.14 Y-.2 | Z-.2 104.71,30.94 C15.1 | TEX1.3 108.59,14.28 108.59,11.74 X-.2 | U$1.GND@4 U$1.GND@3 | U$1.GND@1 45.72,2.21
  Bottom 1.524: 45.72,2.21 106.68,2.21 106.68,3.48 106.68,8.2 104.24,10.63 104.06,10.63 X-.2
  Bottom 2.54: 106.68,3.48 100.86,3.48 100.33,2.96 97.79,2.96 97.26,3.48 97.16,3.48 | 97.16,3.48 96.52,3.48 97.16,3.48 | 97.16,3.48 96.52,4.12
  other vias: 4.45,15.55 6.99,15.55 9.53,15.55 3.81,12.37 6.35,2.85
  pour Top (isolate 0.254, rank 2): 126.83,57.49 126.83,-1 -0.63,-1.59 -0.63,57.49
  pour Bottom (isolate 0.61): 10.8,56.19 24.13,56.82 31.75,49.2 31.75,20.63 30.48,19.99 10.16,19.99 7.62,17.45 1.27,17.45 1.27,28.88 9.53,28.88 9.53,54.92
  pour Bottom (isolate 0.61, rank 3): 31.75,46.03 87,46.03 88.27,44.76 88.27,23.8 96.52,13.64 96.52,3.48 95.25,1.58 5.08,1.58 1.27,5.39 1.27,13.64 38.73,13.64 38.73,39.68 31.75,42.85
  pour Route3 (isolate 0.406, rank 2): 10.16,57.46 28.57,57.46 29.84,56.19 36.83,56.19 36.83,44.12 32.38,39.68 31.75,39.04 31.75,20.63 29.84,18.73 29.84,12.37 31.11,11.1 31.75,10.47 33.02,10.47 41.27,2.21 3.17,2.21 3.17,32.06 13.97,32.06 13.97,49.84 10.16,53.65
HEAT1
  Top 0.2: R13.1 26.35,51.43 27.3,52.38 29.53,52.38 31.43,54.29 U$1.D13
  Bottom 0.2: R9.1 26.67,51.74 28.89,51.74 31.43,54.29 U$1.D13
HEAT2  (via drill 0.4)
  Top 0.2: v28.57,39.04 28.26,39.36 26.67,39.36 R14.1
  Route3 0.2: v28.57,39.04 28.57,48.89 33.97,54.29 U$1.D12
  Bottom 0.2: v28.57,39.04 26.35,39.04 R2.1
HEAT3
  Top 0.2: R15.1 26.35,45.71 26.35,49.84 28.26,49.84 31.43,53.01 35.24,53.01 36.51,54.29 U$1.D11
  Bottom 0.2: R4.1 26.35,46.03 32.38,46.03 36.51,50.16 36.51,54.29 U$1.D11
LED
  Top 0.2: U$1.A10 81.28,3.18 R12.2
N$1
  Top 0.2: Q2.D 19.05,39.04 19.05,36.5 17.08,36.5 LEDD9.C
  Top 1.27: 11.48,40.31 HEAT2.P2 | Q2.D 18.7,39.07 18.7,36.47 13.84,36.47 13.84,39.58 13.61,39.81
  Top 1.524: HEAT2.P2 13.11,40.31 13.61,39.81
  Route2 1.778: Q2.D 18.81,37.54
  pour Route2 (isolate 0.406, rank 2): 5.71,40.31 19.68,40.31 19.68,33.96 5.71,33.96
N$2  (via drill 0.4)
  Top 0.2: v109.22,28.57 113.03,28.57 R18.2
  Bottom 0.61: v109.22,28.57 110.73,30.08 TEX3.1
N$3
  pour Route2 (isolate 0.406, rank 2): 116.21,58.73 124.68,58.73 124.31,7.93 118.11,7.93 118.11,49.2 116.21,51.11
N$7
  Top 0.2: 9.53,52.06 8.57,53.01 HEAT1.P2 | 14.92,48.89 16.51,48.89 18.73,51.11 Q1.D
  Top 0.61: LED10.C 12.05,49.75 11.7,49.47
  Top 1.27: HEAT1.P2 8.36,52.27 9.53,52.27 12.05,49.75 | Q1.D 18.07,50.66 18.07,48.7 13.1,48.7 12.33,49.47 11.7,49.47
  Route2 1.778: Q1.D 19.05,51.17 19.05,49.2
  pour Route2 (isolate 0.406, rank 2): 5.71,54.92 5.71,48.57 19.68,48.57 19.68,54.92
N$12
  Top 0.2: LED5.C 120.97,29.84 121.29,30.15 125.1,30.15 EX3.2
  Bottom 0.2: 114.94,32.38 112.71,32.38 TEX3.2
  Bottom 0.61: TEX3.2 115.24,32.39 115.57,32.06
  Bottom 1.016: EX3.2 120.83,30.24 TEX3.4
  pour Bottom: 114.94,35.87 127.64,35.87 127.64,28.88 114.94,28.88
N$17  (via drill 0.4)
  Top 0.2: v107.95,36.19 117.79,36.19 120.65,33.33 LED5.A
  Bottom 0.61: R20.2 107.95,39.03 v107.95,36.19
N$22
  Top 0.2: LED7.C 120.97,39.04 125.1,39.04 EX2.2
  Bottom 0.61: TEX2.2 112.31,41.27 114.94,41.27
  Bottom 1.016: EX2.2 120.3,39.33 TEX2.4
  pour Bottom: 114.94,44.76 127.64,44.76 127.64,37.77 114.94,37.77
N$24  (via drill 0.4)
  Top 0.2: v109.54,47.3 112.08,47.3 R26.2
  Bottom 0.61: TEX4.1 110.09,47.85 v109.54,47.3
N$28
  Top 0.2: LED6.C 120.97,48.89 125.1,48.89 EX4.2
  Bottom 0.61: TEX4.2 114.93,50.16 114.94,50.16
  Bottom 1.016: EX4.2 119.74,49.09 TEX4.4
  pour Bottom: 114.94,53.65 114.94,46.66 127.64,46.66 127.64,53.65
N$32
  Top 0.406: LEDD8.A 13.24,42.31 13.97,41.59 20.09,41.59 R23.2
N$34  (via drill 0.4)
  Top 0.2: v107.63,53.97 119.38,53.97 120.65,52.7 LED6.A
  Bottom 0.61: R28.2 108.96,55.29 v107.63,53.97
N$36  (via drill 0.4)
  Top 0.2: v109.22,38.41 112.4,38.41 R29.2
  Bottom 0.61: v109.22,38.41 109.69,38.88 TEX2.1
N$38  (via drill 0.4)
  Top 0.2: v107.63,45.71 117.79,45.71 120.65,42.85 LED7.A
  Bottom 0.2: 107.63,46.03 v107.63,45.71
  Bottom 0.61: R31.2 108.48,48.14 107.63,47.3 107.63,46.03
N$40  (via drill 0.4)
  Top 0.2: v107.95,9.52 110.17,9.52 110.73,10.08 R32.2
  Bottom 0.61: TEX1.1 110.16,11.73 v107.95,9.52
N$41
  Top 0.2: LED8.C 121.6,9.83 121.92,10.15 125.1,10.15 EX1.2
  Bottom 0.2: 114.94,13.96 112.71,13.96 TEX1.2
  Bottom 0.61: TEX1.2 115.33,14.04 115.57,14.28
  pour Bottom: 114.94,18.09 127.64,18.09 127.64,9.2 114.94,9.2
N$42  (via drill 0.4)
  Top 0.305: v107.95,19.04 109.22,18.09 110.49,18.09 LED8.A
  Bottom 0.61: v107.95,19.04 108.45,18.54 R34.2
N$44  (via drill 0.4)
  Top 0.61: R35.2 109.42,19.16 v109.22,19.36
  Bottom 0.61: v109.22,19.36 110.48,20.62 TEX0.1
N$45
  Top 0.61: LEDD9.A 16.59,33.39 R24.2
N$46
  Top 0.2: R12.1 75.76,3.15 LED1.A
N$47
  Top 0.2: R14.2 24.45,39.36 21.59,39.36 Q2.G
N$48
  Top 0.2: R13.2 24.45,51.43 21.59,51.43 Q1.G
N$49
  Top 0.2: R15.2 24.45,45.71 21.59,45.71 Q3.G
N$50
  Top 0.61: R25.2 12.76,55.07 LED10.A
N$51
  Top 1.27: LEDD8.C 9.74,45.81 8.89,46.66 HEAT3.P2 | 12.57,45.81 12.57,46.03 15.53,43.07 17.02,43.07 18.07,44.13 18.07,45.05 18.41,45.39 18.43,45.39 Q3.D
  Top 1.524: 12.57,45.81 LEDD8.C
  Route2 1.778: Q3.D 18.81,44.36 19.05,44.12
  pour Route2 (isolate 0.406, rank 2): 5.71,47.3 19.68,47.3 19.68,41.59 5.71,41.59 5.71,46.66
N$53
  Top 1.016: F2.P$3 F2.P$1 F2.P$2 | F2.P$3 9.94,8.97 F2.P$2 | F2.P$3 F2.P$4 11.52,8.97 F2.P$2
  Top 1.27: +24.1 6.86,6.85 11.88,6.85 12.07,6.66
  Top 2.54: F2.P$2 6.86,6.85 11.88,6.85 | F2.P$1 11.52,8.97 | 11.52,8.97 F2.P$4 | 11.88,6.85 12.07,6.66 | 11.88,6.85 11.88,8.61 11.52,8.97
N$54
  Top 0.2: 6.03,24.12 5.84,24.19 +12.1
  Top 1.27: F1.P$2 9.13,22.29 8.25,23.17 8.25,24.19
  Top 2.54: F1.P$4 12.05,24.83 F1.P$1 10.45,24.19 8.25,24.19 5.84,24.19 | F1.P$2 13.63,24.83 F1.P$3
N$56
  Top 0.2: LED9.C 120.97,20.63 125.1,20.63 EX0.2
  Bottom 0.2: 114.94,22.85 112.4,22.85 TEX0.2
  Bottom 0.61: TEX0.2 118.35,22.93 118.75,22.53 118.54,22.74 TEX0.4
  pour Bottom: 114.94,26.98 127.64,26.98 127.64,19.36 114.94,19.36
N$57  (via drill 0.4)
  Top 0.305: LED9.A 118.27,26.34 v110.49,26.34
  Bottom 0.305: v110.49,26.34 107.65,26.34 R37.2
RESET
  Top 0.813: U$1.RES 35.56,7.93 39.66,12.03 40.01,12.03 | 40.01,12.03 U$2.P$4 | 40.01,12.03 U$2.P$3
  Top 1.524: U$2.P$3 32.6,12.03 RSET.1
SCK
  Top 0.2: E0.SCK 87.63,54.29 U$1.D20 | Z.SCK 87.63,35.23 72,35.23 71.93,35.17 70.31,35.17 70.25,35.23 67.95,35.23 | Y.SCK 67.95,35.23 | X.SCK 43.18,32.06 38.73,32.06 38.1,32.7 38.1,35.23 67.95,35.23
  Bottom 0.2: X.SCK 44.45,35.23 43.18,36.5 43.18,48.57 E2.SCK | Y.SCK 66.04,35.23 64.77,36.5 64.77,48.57 E1.SCK | E0.SCK 87.63,39.04 86.36,37.77 86.36,34.6 Z.SCK
SDI
  Top 0.2: U$1.D21 88.9,49.84 E0.SDI | E2.SDI 48.26,48.57 57.78,48.57 60.32,51.11 67.31,51.11 E1.SDI | Z.SDI 88.9,32.06 87,32.06 86.36,32.7 86.36,34.6 69.85,34.6 Y.SDI
  Bottom 0.2: Z.SDI 90.17,34.6 88.9,35.87 88.9,48.57 E0.SDI | X.SDI 46.99,35.23 45.72,36.5 45.72,48.57 E2.SDI | Y.SDI 68.58,35.23 69.85,36.5 69.85,44.12 68.58,45.39 E1.SDI
SDO
  Top 0.2: E0.SDO 82.55,54.29 U$1.D19 | X.SDO 40.64,34.6 59.69,34.6 Y.SDO 62.23,32.06 81.28,32.06 Z.SDO
  Bottom 0.2: E2.SDO 39.37,39.04 38.1,37.77 38.1,34.6 X.SDO | E1.SDO 60.96,48.89 62.23,47.62 62.23,34.6 Y.SDO | E0.SDO 82.55,39.04 81.28,37.77 81.28,34.6 Z.SDO
SERVO0
  Route2 0.2: U$1.D44 97.16,23.8 98.43,25.07 99.7,25.07 101.92,27.3 101.92,46.03 103.19,47.3 SERV0.3
SERVO1
  Route3 0.2: U$1.D45 99.06,24.44 102.23,27.61 102.23,36.5 103.19,37.46 SERV1.3
THERM0
  Top 0.305: R7.1 94.5,5.5 U$1.A15
  Top 0.406: U$1.A15 92.97,7.04 T0.1
  Bottom 0.406: T0.1 C5.+
THERM1
  Top 0.305: U$1.A14 91.44,3.81 R1.1
  Top 0.406: T1.1 91.44,6.28 U$1.A14
  Bottom 0.406: T1.1 C1.+
THERM2
  Top 0.305: U$1.A13 88.9,3.67 R11.1
  Top 0.406: T2.1 84.63,8.56 86.36,8.56 U$1.A13
  Bottom 0.406: T2.1 C8.+
THERM3
  Top 0.305: U$1.A12 86.36,3.53 R17.1
  Top 0.406: T3.1 80.18,9.04 81.61,7.62 84.77,7.62 U$1.A12
  Bottom 0.406: T3.1 C12.+
VCC
  Top 0.508: R17.2 R11.2 R1.2 R7.2 95.93,2.85 103.51,2.85 103.51,8.65 X-.3
  Bottom 0.254: 48.26,35.87 48.26,41.9 50.8,44.44 R8.1 | 48.26,35.87 48.26,32.7 48.89,31.42 51.12,29.2 R3.1 | Z.VDD 72.71,25.39 72.71,28.88 R5.1 | E0.VDD 72.39,42.22 72.39,45.08 R10.1 | 91.44,32.7 91.44,37.14 92.08,37.77 100.01,37.77 | 92.35,54.92 92.41,54.99 R16.1 | R34.1 104.78,17 104.78,16.5 104.66,16.31 | 48.26,35.87 54.61,35.87 E1.VDD | 92.08,32.06 91.44,32.7 | 91.44,32.7 92.08,32.06 | 92.08,32.06 92.08,31.42 93.35,30.15 93.98,30.15 94.32,29.82 R6.1
  Bottom 0.508: SERV0.2 104.2,49.12 R31.1
  Bottom 0.61: SERV1.2 104,40.7 R20.1 | 92.35,54.92 95.89,54.92 U$1.5V@1 | Z-.3 105.48,25.34 R37.1
  Bottom 1.016: Y-.3 104.59,17.2 R34.1 | R28.1 104.04,55.45 100.97,52.38 100.97,52.36
  pour Bottom (isolate 0.406, rank 3): 97.79,56.82 105.41,56.82 104.78,8.56 97.79,8.56
  pour Route3 (isolate 0.406, rank 3): 44.45,0.94 33.02,12.37 33.02,37.77 35.56,40.31 80.01,40.31 95.25,55.55 131.44,56.15 131.44,0.33
X-CS
  Bottom 0.2: X.CS 41.91,30.15 51.44,20.63 51.44,9.83 54.61,6.66 54.61,5.39 55.24,4.76 59.69,4.76 U$1.A3
X-DIR
  Top 0.508: 31.75,4.76 32.38,4.12 51.44,4.12 U$1.A0
  Top 0.61: X.DIR 33.66,29.52 33.66,24.53 33.02,23.89 33.02,23.17 32.38,22.53 31.11,22.53 30.48,21.9 30.34,21.21 30.34,6.16 31.75,4.76
  Bottom 0.2: 50.16,7.93 47.1,10.99 46.99,11.42
  Bottom 0.254: 33.02,18.09 33.02,22.53
  Bottom 0.406: X.DIR 33.02,32.06 33.02,22.53 | U$1.A0 52.07,6.03 50.16,7.93 46.99,11.1 46.99,11.42 46.99,18.09 33.02,18.09
X-EN
  Bottom 0.2: X.EN 51.12,31.74 51.12,31.11 R3.2 | 63.5,9.83 U$1.A4 | 58.26,16.03 62.39,11.9
  Bottom 0.203: 58.26,16.03 57.94,16.34 57.16,19.36 57.09,21.27 57.09,22.53 54.92,27.3 R3.2 | 62.39,11.9 63.5,9.83
X-MIN
  Top 0.2: X.DIAG0 54.61,23.17 54.61,14.92 | 54.61,14.92 54.61,7.93 56.52,7.93 U$1.A2 | 54.61,14.92 102.23,14.92 103.19,13.96 X-.1
  Bottom 0.2: C11.2 105.73,13.96 103.51,13.96 X-.1
X-STEP
  Top 0.2: X.STEP 38.42,29.2 43.81,29.2 52.07,20.95 52.07,7.29 54.61,7.29 U$1.A1
Y-CS
  Bottom 0.2: 64.77,13.01 64.77,21.27 | U$1.A7 65.41,11.74
  Bottom 0.203: 65.41,11.74 64.77,13.01 | 64.77,21.27 Y.CS
Y-DIR
  Bottom 0.2: 59.69,21.9 59.69,16.82 | 65.41,9.83 60.32,14.92 | 66.04,7.93 U$1.A5
  Bottom 0.203: 65.41,9.83 66.04,7.93 | 60.32,14.92 59.69,16.82 | Y.DIR 59.69,21.9
Y-EN
  Route3 0.2: U$1.A8 76.2,10.15 72.39,13.96 72.39,32.06 Y.EN
  Bottom 0.2: Y.EN 72.39,32.06 72.39,31.11 R5.2
Y-MIN
  Top 0.2: Y.DIAG0 88.58,29.52 93.03,25.07 101.6,25.07 103.19,23.49 Y-.1
  Bottom 0.2: Y.DIAG0 69.85,23.8 72.71,20.95 72.71,7.61 75.57,4.76 77.47,4.76 U$1.A9
  Bottom 0.61: C13.2 103.6,23.27 Y-.1
Y-STEP
  Bottom 0.2: 62.23,15.55 62.23,21.9 | 67.47,8.72 62.71,13.49 | 68.58,6.66 U$1.A6
  Bottom 0.203: 67.47,8.72 68.58,6.66 | 62.71,13.49 62.23,15.55 | 62.23,21.9 Y.STEP
Z-CS
  Top 0.2: Z.CS 85.09,31.42 U$1.D38
Z-DIR
  Top 0.2: U$1.D39 97.79,30.15 97.79,26.34 U$1.D42
  Bottom 0.2: Z.DIR 75.57,33.33 82.55,26.34 U$1.D42
Z-EN
  Bottom 0.254: R6.2 | U$1.D36 93.35,33.96 Z.EN 94.27,31.77 R6.2 | U$1.D36 96.51,33.96 | U$1.D36 R6.2 | R6.2
Z-MAX
  Route3 0.2: Z.DIAG0 91.44,26.34 U$1.D46
Z-MIN
  Bottom 0.2: 106,32.34 C15.2
  Bottom 1.016: Z-.1 106,32.34
Z-STEP
  Bottom 0.2: Z.STEP 80.65,33.33 86.68,27.3 94.93,27.3 95.57,27.3 95.89,27.61 U$1.D40

### Text on the board
tNames: + | gnd | + | gnd | Z- | + | gnd | +5 | + | Y- | gnd | +5 | X- | + | gnd | +5
bNames: + | + | + | +
tValues: + | + | + | + | + | + | + | +
Document: RAMPS 1.4.2.1 (RepRap Arduino MEGA Pololu Shield) | GPL v3 | reprap.org/wiki/RAMPS1.4 | Reversing input power, and inserting stepper drivers incorrectly will destroy electronics. | I2C | 21 | 20 | 12-35V Out | GND | 5V | - | D10 | + | AUX-4 | D16 | - | D17 | D9 | + | D23 | D25 | - | D11 | D27 | + | D29 | D31 | 12-35VDC In | D33 | + | D35 | 11A | D37 | - | D38 | D41 | + | 5A | D43 | - | D45 | SERVOS | AUX-1 | AUX-2 | AUX-3 / SPI | D11 | D6 | D5 | D4 | D47 | A9 | A11 | SCK | MISO | D32 | 5V | GND | D2 | D1 | GND | D63 | D48 | D42 | D65 | GND | D52 | D50 | 5V | 5V | 5V | 5V | 5V | GND | 5V | GND | A3 | A4 | 5V | A5 | A10 | D44 | A12 | NC | D53 | MOSI | D49 | D57 | D58 | D59 | D64 | D66 | D51 | 5V | GND | GND | GND | GND | Copyright 2011 Johnny Russell - UltiMachine
_tsilk: + | I2C | END STOPS | 21 | 1 | 20 | 1 | - | + | 1 | + | 1 | 1 | 1 | 1 | 1 | 1 | 1 | -